# Altium schematic sheet Power.SchDoc
size A; DocumentNumber: 11; SheetNumber: 11; SheetTotal: 16
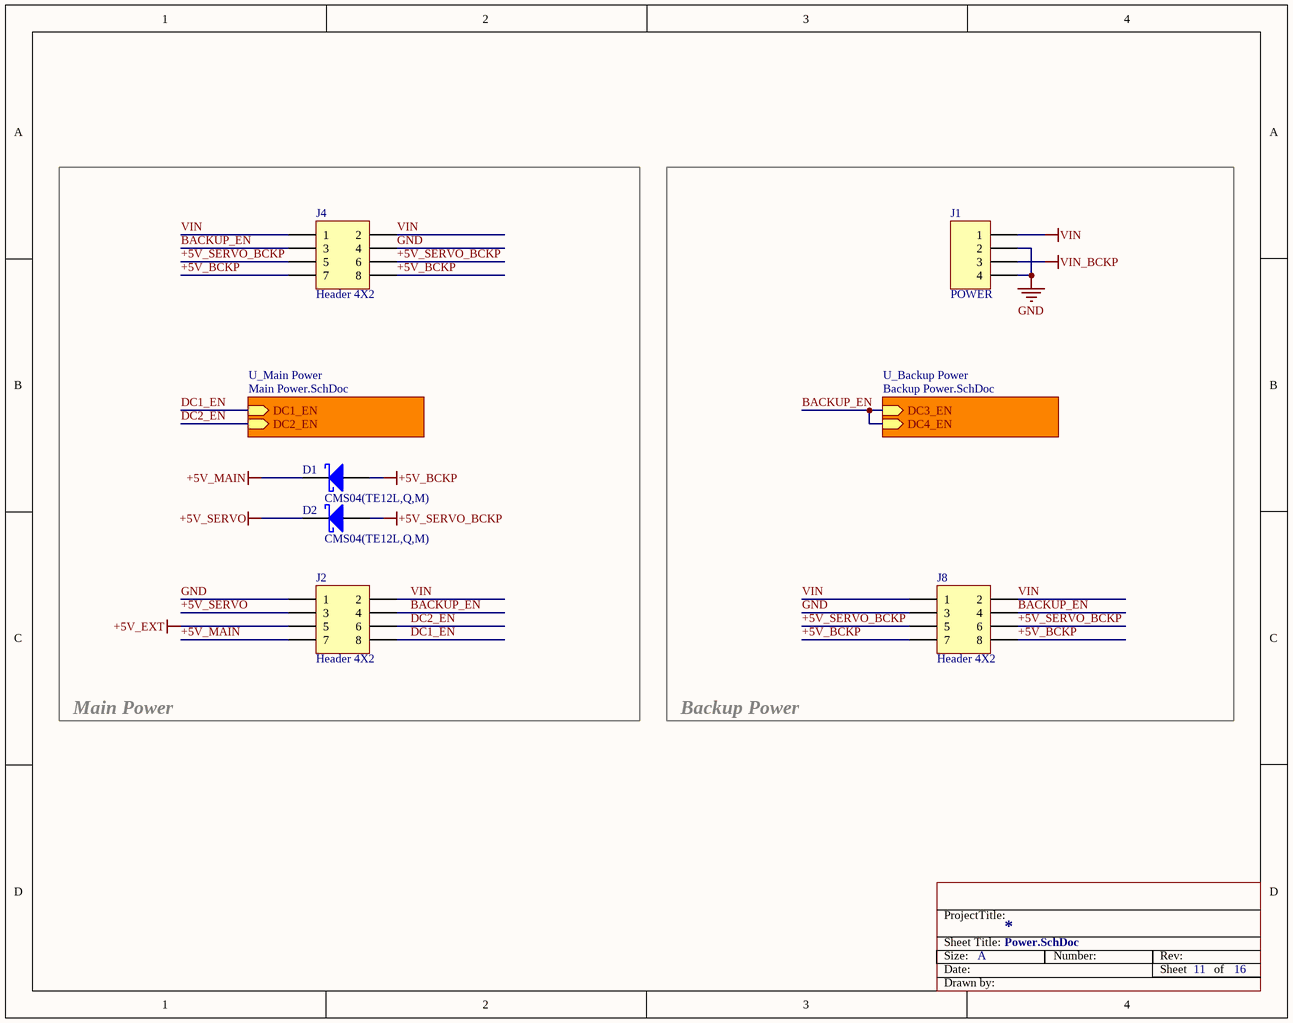
[diagram p0: Power.SchDoc]

## Parts
D1  Manufacturer Part Number: CMS04(TE12L,Q,M)  [SOD-128]  (hidden comment: SCHOTTKY DIODE)
D2  Manufacturer Part Number: CMS04(TE12L,Q,M)  [SOD-128]  (hidden comment: SCHOTTKY DIODE)
J1  POWER  [1X04_v2]  (no BOM)
J2  Header 4X2  [2X04]  (no BOM)
J4  Header 4X2  [2X04]  (no BOM)
J8  Header 4X2  [2X04]  (no BOM)

## Blocks framed on the sheet
Main Power: D1 D2 J2 J4
Backup Power: J1 J8

## Sub-sheets
U_Backup Power = Backup Power.SchDoc: DC3_EN (in), DC4_EN (in)
U_Main Power = Main Power.SchDoc: DC1_EN (in), DC2_EN (in)

## Nets
+5V_BCKP: D1.1(A) J4.7 J4.8 J8.7 J8.8
+5V_EXT: J2.5
+5V_MAIN: D1.2(K) J2.7
+5V_SERVO: D2.2(K) J2.3
+5V_SERVO_BCKP: D2.1(A) J4.5 J4.6 J8.5 J8.6
GND: J1.2 J1.4 J2.1 J4.4 J8.3
VIN: J1.1 J2.2 J4.1 J4.2 J8.1 J8.2
VIN_BCKP: J1.3
BACKUP_EN: J2.4 J4.3 J8.4 ; sheet U_Backup Power/DC3_EN, sheet U_Backup Power/DC4_EN
DC1_EN: J2.8 ; sheet U_Main Power/DC1_EN
DC2_EN: J2.6 ; sheet U_Main Power/DC2_EN

## Notes on the sheet
- Sheet Title:
- ProjectTitle:
- Size:
- Date:
- A
- Number:
- Rev:
- Sheet         of
- Drawn by:

## Library data of the parts
D1 D2 = SCHOTTKY DIODE: Typical Schottky Diode; Manufacturer: Toshiba Semiconductor and Storage; Capacitance @ Vr, F: 330pF @ 10V, 1MHz; Voltage - DC Reverse (Vr) (Max): 30V; Voltage - Forward (Vf) (Max) @ If: 370mV @ 5A; Current - Average Rectified (Io): 5A; Speed: Fast Recovery =< 500ns, > 200mA (Io); Current - Reverse Leakage @ Vr: 8mA @ 30V; Supplier 1: Digi-Key; Supplier Part Number 1: CMS04(TE12LQM)CT-ND; ComponentLink1URL: http://toshiba.semicon-storage.com/info/docget.jsp?did=3133&prodName=CMS04; ComponentLink1Description: Datasheet
J1 = Header 4: Header, 4-Pin
J2 J4 J8 = Header 4X2: Header, 4-Pin, Dual row